# EAGLE board hoektronics-cnc-controller (EAGLE 5.12)
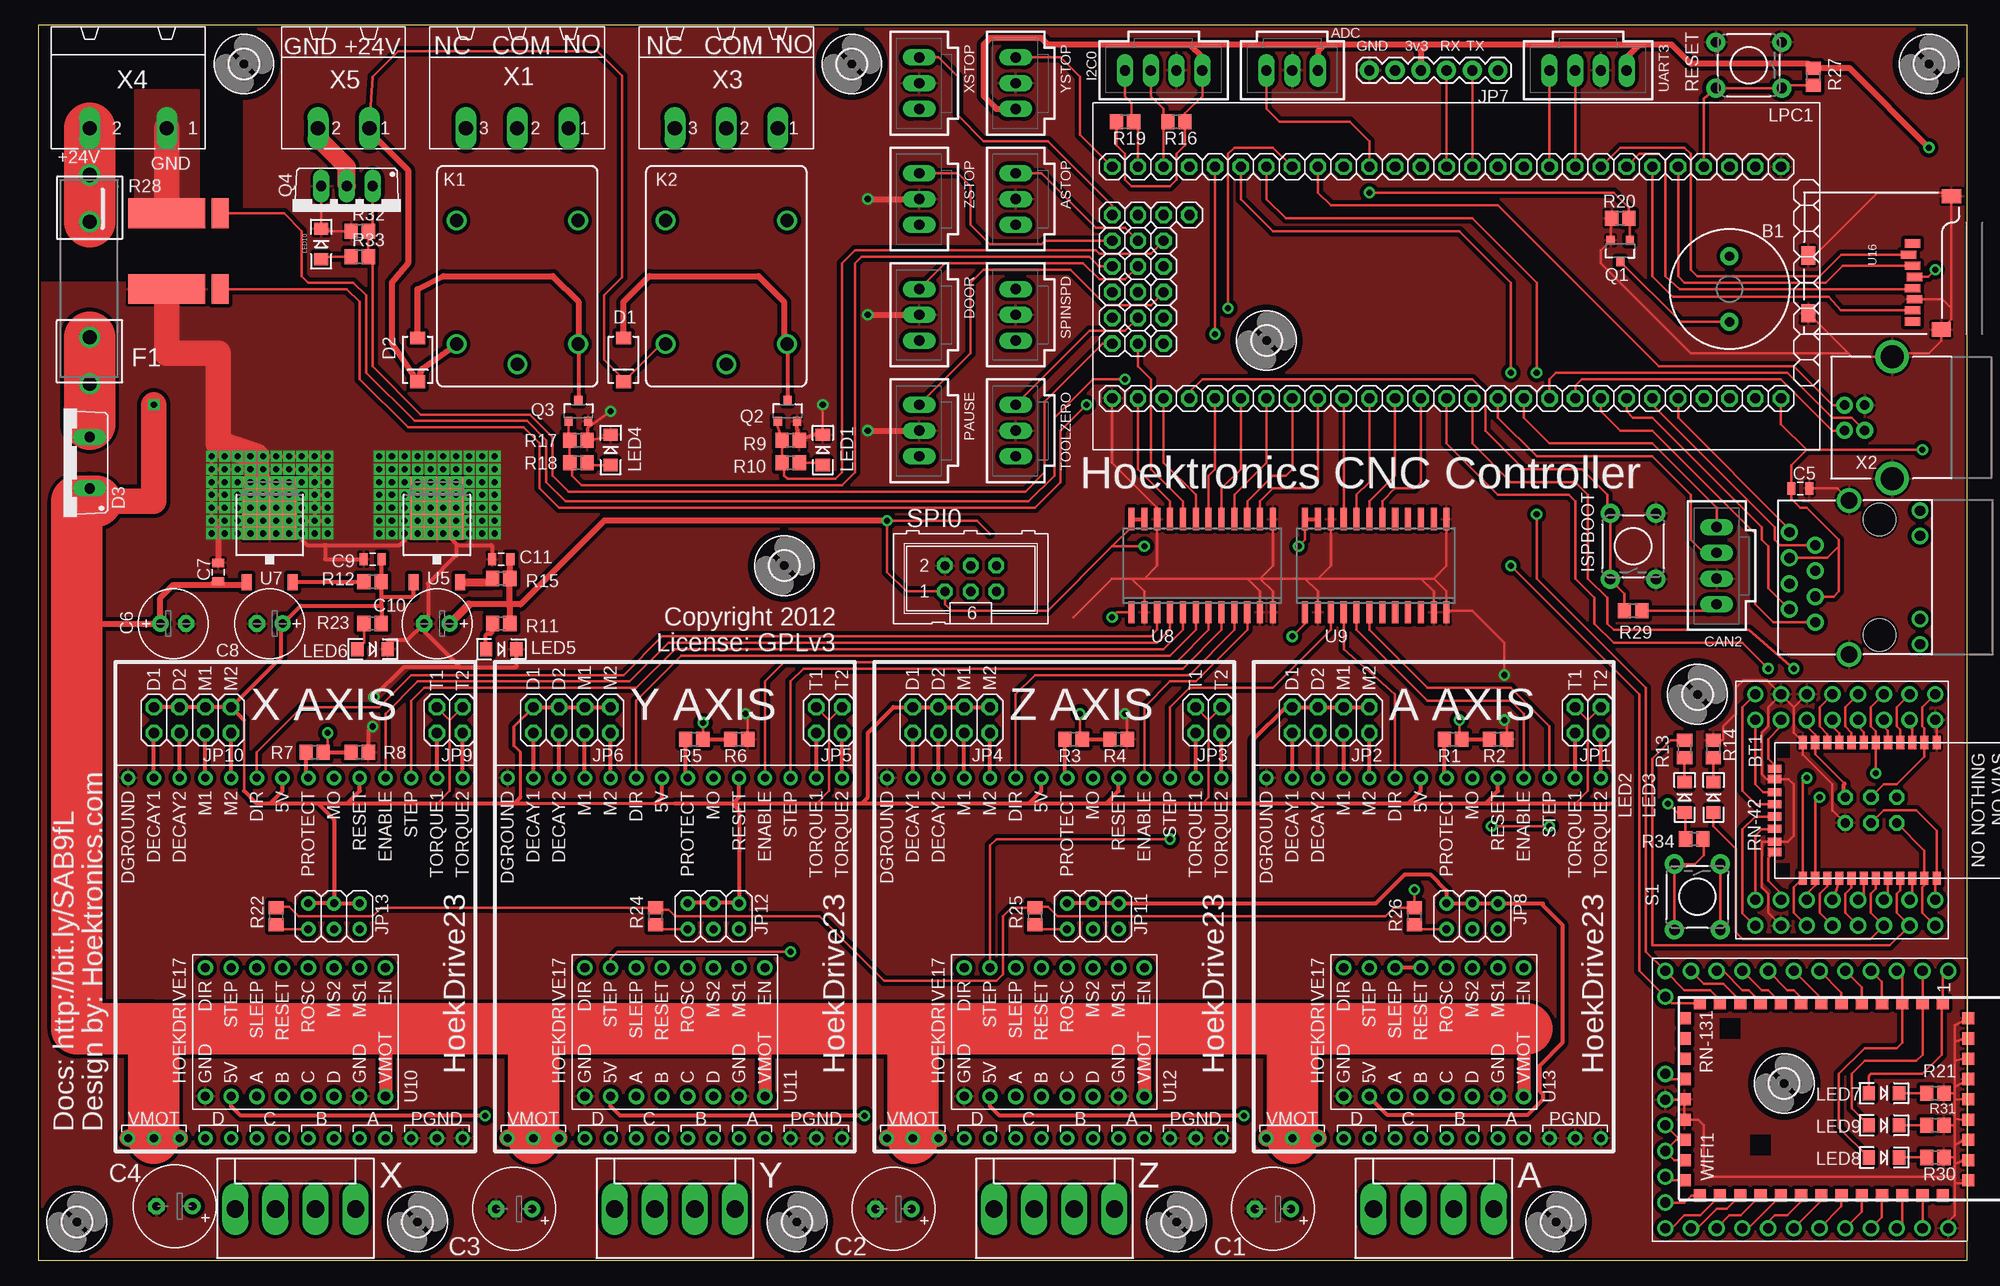
[diagram p9: board, top side]
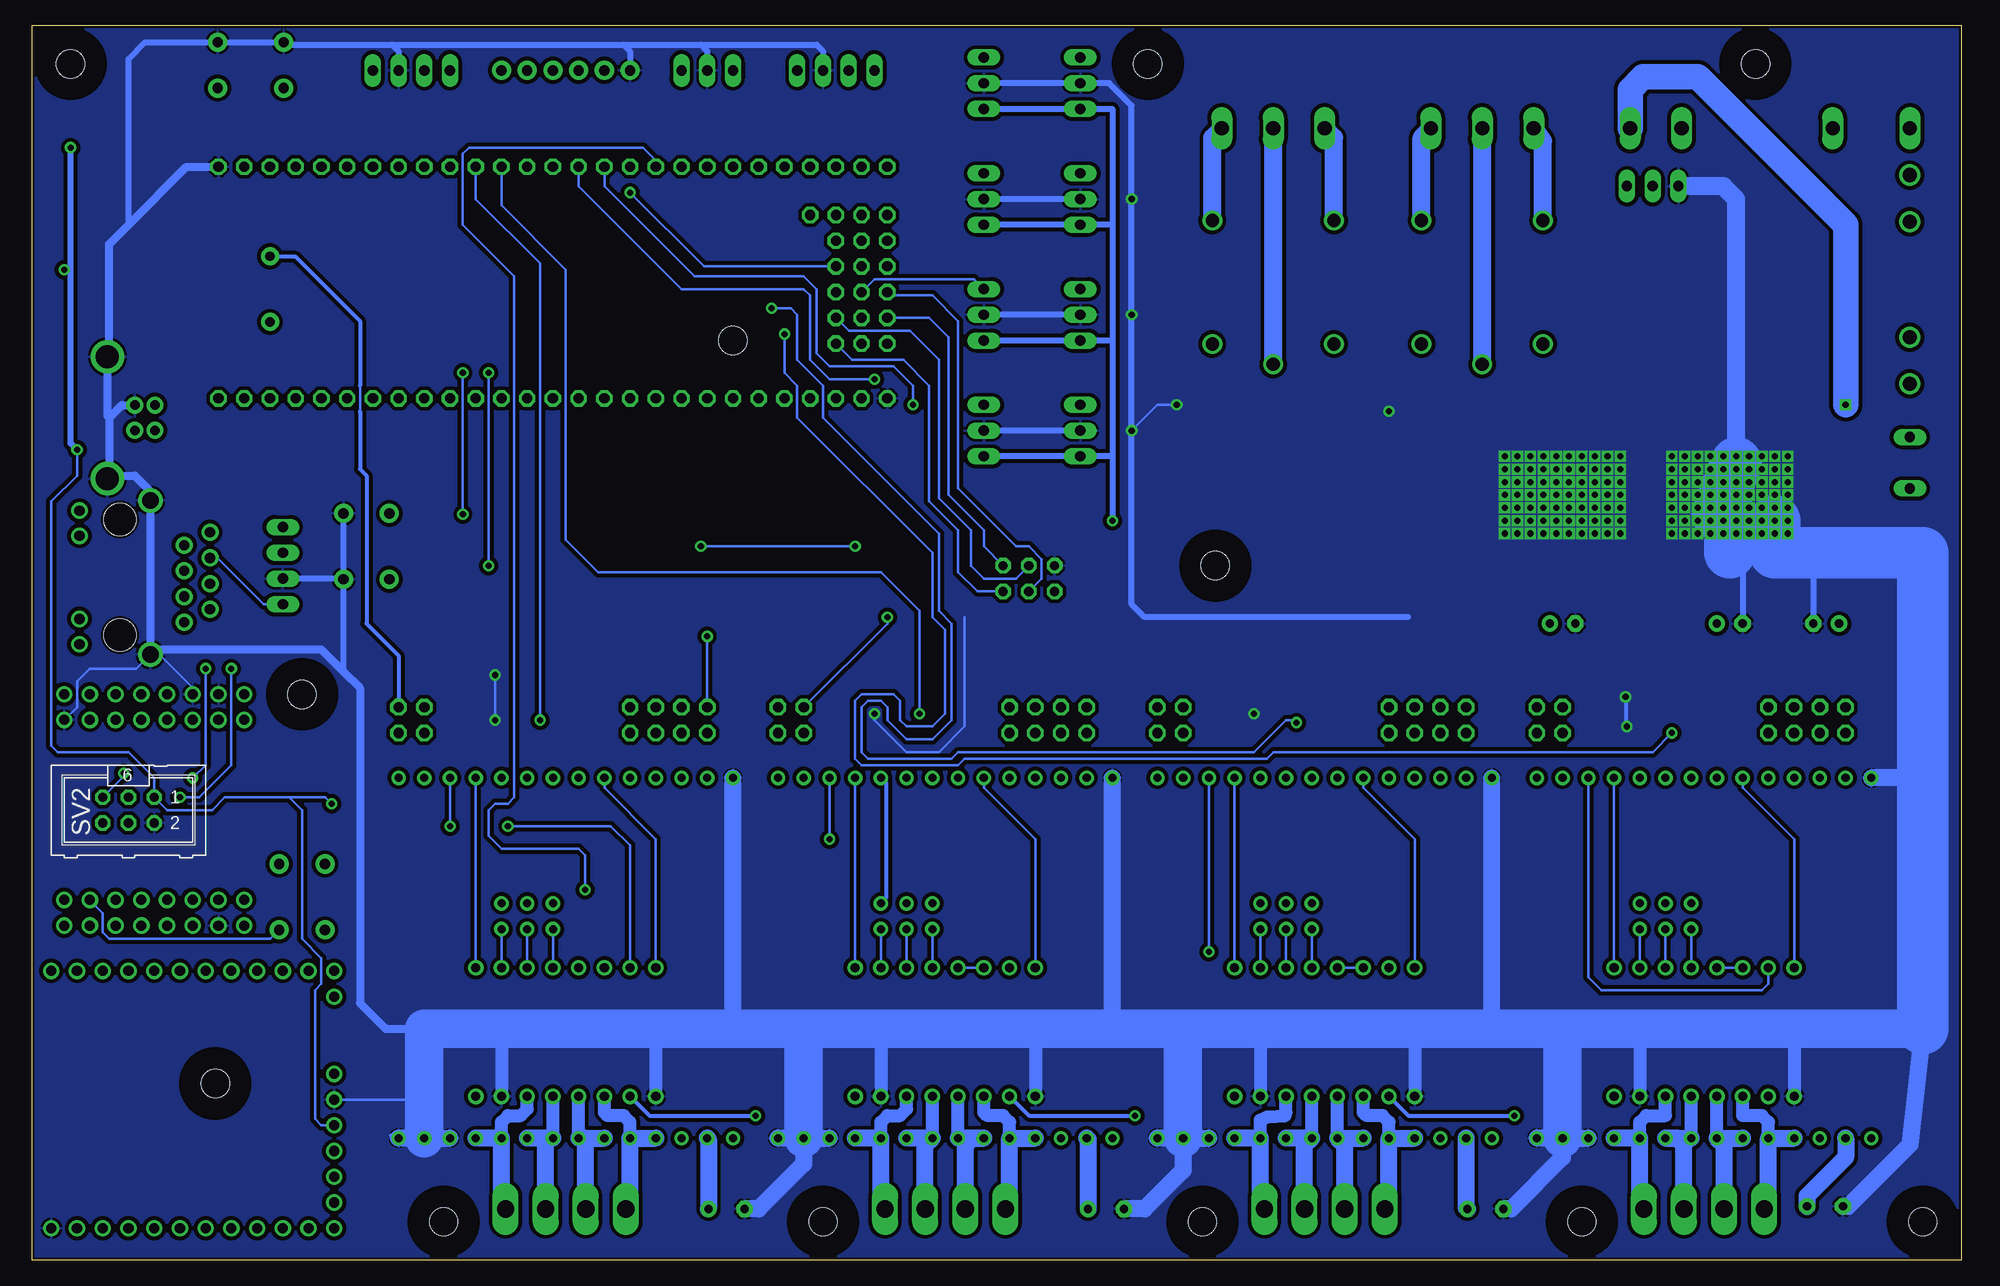
[diagram p10: board, bottom side, seen from below]

Size 190.5 x 121.92 mm. Coordinates in mm from the lower left corner, seen from the top.
Outline: 190.5,121.92 0,121.92 0,0 190.5,0 190.5,121.92
Copper layers (1*16): Top 0.035mm / dielectric 1.5mm / Bottom 0.035mm
Design rules "hoektronics *": minimum track width 8mil, minimum drill 20mil, track to track 8mil, track to pad 8mil, pad to pad 8mil, via to via 8mil, smd to smd 8mil, copper to edge 10mil, drill to drill 8mil, minimum pad ring 12mil, minimum via ring 10mil, stop-mask expansion 4mil, vias tented up to drill 25mil, thermal gap 10mil
Net classes: 0 default: width 0.406 mm, clearance 0.381 mm; 1 power: width 1.524 mm, clearance 0.635 mm; 2 highvolt: width 1.778 mm, clearance 3.175 mm; 3 signals: width 0.254 mm, clearance 0.318 mm

## Footprints (pad centres in the part's own frame; a part is rotated, then mirrored left to right if it is on the bottom)
KK-156-4 = drill 1.7 pad 2.184 long: 1 -5.94,0; 2 -1.98,0; 3 1.98,0; 4 5.94,0
70543-03 = drill 1.016 long: 1 -2.54,0; 2 0,0; 3 2.54,0
BUZZER-12MM = drill 0.9 pad 1.778 round: + 3.25,0; - -3.25,0
RN-42 = smd 1.3 x 0.8: 1 0,16; 2 0,14.8; 3 0,13.6; 4 0,12.4; 5 0,11.2; 6 0,10; 7 0,8.8; 8 0,7.6; 9 0,6.4; 10 0,5.2; 11 0,4; 12 0,2.8; 13 13.4,2.8; 14 13.4,4; 15 13.4,5.2; 16 13.4,6.4; 17 13.4,7.6; 18 13.4,8.8; 19 13.4,10; 20 13.4,11.2; 21 13.4,12.4; 22 13.4,13.6; 23 13.4,14.8; 24 13.4,16 | smd 0.8 x 1.3: 28 9.8,0; 29 3.6,0; 30 10.8,0; 31 8.5,0; 32 7.3,0; 33 6.1,0; 34 4.9,0; 35 2.6,0
RN-42-CARRIER = drill 1 round: P$1 -2.237,15.875; P$2 -4.777,15.875; P$3 -2.237,13.335; P$4 -4.777,13.335; P$5 -2.237,10.795; P$6 -4.777,10.795; P$7 -2.237,8.255; P$8 -4.777,8.255; P$9 -2.237,5.715; P$10 -4.777,5.715; P$11 -2.237,3.175; P$12 -4.777,3.175; P$13 -2.237,0.635; P$14 -4.777,0.635; P$15 -2.237,-1.905; P$16 -4.777,-1.905; P$17 18.067,-1.905; P$18 15.527,-1.905; P$19 18.067,0.635; P$20 15.527,0.635; P$21 18.067,3.175; P$22 15.527,3.175; P$23 18.067,5.715; P$24 15.527,5.715; P$25 18.067,8.255; P$26 15.527,8.255; P$27 18.067,10.795; P$28 15.527,10.795; P$29 18.067,13.335; P$30 15.527,13.335; P$31 18.067,15.875; P$32 15.527,15.875
E3,5-8 = drill 0.813 pad 1.6 round: + -1.778,0 | drill 0.813 pad 1.6 octagon: - 1.778,0
0805 = smd 0.8 x 1.2: 1 -0.9,0; 2 0.9,0
E2,5-7 = drill 0.813 pad 1.6 round: + -1.27,0 | drill 0.813 pad 1.6 octagon: - 1.27,0
70543-04 = drill 1.016 long: 1 -3.81,0; 2 -1.27,0; 3 1.27,0; 4 3.81,0
SMA-DIODE = smd 1.27 x 1.47: A -2.15,0; C 2.15,0
DO220S = drill 1.016 long: A 2.54,-2.54; C -2.54,-2.54
FUSE_5MM = drill 1.4 round: 1 0,10.3; 2 0,5.7; 3 0,-5.7; 4 0,-10.3
2,8 = hole 2.8: 0,0
TACTILE-PTH = drill 1.016 pad 1.88 round: 1 -3.251,2.261; 2 3.251,2.261; 3 -3.251,-2.261; 4 3.251,-2.261
2X02 = drill 1.016 octagon: 1 -1.27,-1.27; 2 -1.27,1.27; 3 1.27,-1.27; 4 1.27,1.27
2X04 = drill 1.016 octagon: 1 -3.81,-1.27; 2 -3.81,1.27; 3 -1.27,-1.27; 4 -1.27,1.27; 5 1.27,-1.27; 6 1.27,1.27; 7 3.81,-1.27; 8 3.81,1.27
1X06 = drill 1.016 pad 1.88 round: 1 0,0; 2 2.54,0; 3 5.08,0; 4 7.62,0; 5 10.16,0; 6 12.7,0
2X03 = drill 0.8 round: 1 -2.54,-1.27; 2 -2.54,1.27; 3 0,-1.27; 4 0,1.27; 5 2.54,-1.27; 6 2.54,1.27
JS-M = drill 1.3 round: 1 6.7,6; 2 6.7,-6; C 8.7,0; NC -5.5,-6; NO -5.5,6
LED-1206 = smd 1.2 x 1.4: A -1.5,0; C 1.5,0
LPCXPRESSO_LPC1769 = drill 1 octagon: 1 3.81,6.35; 2 6.35,6.35; 3 8.89,6.35; 4 11.43,6.35; 5 13.97,6.35; 6 16.51,6.35; 7 19.05,6.35; 8 21.59,6.35; 9 24.13,6.35; 10 26.67,6.35; 11 29.21,6.35; 12 31.75,6.35; 13 34.29,6.35; 14 36.83,6.35; 15 39.37,6.35; 16 41.91,6.35; 17 44.45,6.35; 18 46.99,6.35; 19 49.53,6.35; 20 52.07,6.35; 21 54.61,6.35; 22 57.15,6.35; 23 59.69,6.35; 24 62.23,6.35; 25 64.77,6.35; 26 67.31,6.35; 27 69.85,6.35; 28 3.81,29.21; 29 6.35,29.21; 30 8.89,29.21; 31 11.43,29.21; 32 13.97,29.21; 33 16.51,29.21; 34 19.05,29.21; 35 21.59,29.21; 36 24.13,29.21; 37 26.67,29.21; 38 29.21,29.21; 39 31.75,29.21; 40 34.29,29.21; 41 36.83,29.21; 42 39.37,29.21; 43 41.91,29.21; 44 44.45,29.21; 45 46.99,29.21; 46 49.53,29.21; 47 52.07,29.21; 48 54.61,29.21; 49 57.15,29.21; 50 59.69,29.21; 51 62.23,29.21; 52 64.77,29.21; 53 67.31,29.21; 54 69.85,29.21; 55 62.23,11.1; 56 64.77,11.1; 57 67.31,11.1; 58 69.85,11.1; 59 64.77,13.64; 60 67.31,13.64; 61 69.85,13.64; 62 64.77,16.18; 63 67.31,16.18; 64 69.85,16.18; 65 64.77,18.72; 66 67.31,18.72; 67 69.85,18.72; 68 64.77,21.26; 69 67.31,21.26; 70 69.85,21.26; 71 64.77,23.8; 72 67.31,23.8; 73 69.85,23.8
SOT23-3 = smd 0.8 x 0.9: 1 -0.95,-1; 2 0.95,-1; 3 0,1.1
TO220BV = drill 1.016 long: D 0,-2.54; G -2.54,-2.54; S 2.54,-2.54
R0805 = smd 1.3 x 1.5: 1 -0.85,0; 2 0.85,0
WSL3637 = smd 7.62 x 2.946: 1 3.81,8.738; 4 3.81,1.27 | smd 1.676 x 2.946: 2 9.068,8.738; 3 9.068,1.27
ML6 = drill 0.914 octagon: 1 -2.54,-1.27; 2 -2.54,1.27; 3 0,-1.27; 4 0,1.27; 5 2.54,-1.27; 6 2.54,1.27
HOEKSTEP23 = drill 0.8 round: A1 17.78,7.62; A2 17.78,5.08; B1 17.78,2.54; B2 17.78,0; C1 17.78,-2.54; C2 17.78,-5.08; CLOCK -17.78,10.16; D1 17.78,-7.62; D2 17.78,-10.16; DCY1 -17.78,-15.24; DCY2 -17.78,-12.7; DGND -17.78,-17.78; DIR -17.78,-5.08; EN -17.78,7.62; M1 -17.78,-10.16; M2 -17.78,-7.62; MO -17.78,2.54; PGND1 17.78,15.24; PGND2 17.78,12.7; PGND3 17.78,10.16; PROTECT -17.78,0; RESET -17.78,5.08; TQ1 -17.78,12.7; TQ2 -17.78,15.24; VCC -17.78,-2.54; VMOT1 17.78,-12.7; VMOT2 17.78,-15.24; VMOT3 17.78,-17.78
TO252 = smd 1 x 1.6: 1 -2.28,-4.8; 2 2.28,-4.8 | smd 5.4 x 6.2: 3 0,2.5
MAGJACK = drill 1 pad 1.676 round: 1 3.175,17.445; 2 4.445,19.985; 3 5.715,17.445; 4 6.985,19.985; 5 8.255,17.445; 6 9.525,19.985; 7 10.795,17.445; 8 12.065,19.985 | drill 1 pad 1.27 round: 9 1,7.1; 10 3.5,7.1; 11 11.7,7.1; 12 14.2,7.1 | drill 1.6 pad 2.184 round: GNDL 0,14.1; GNDR 15.2,14.1 | hole 3.2: 1.905,11.095; 13.335,11.095
SO24W = smd 0.6 x 2.2: 1 -6.985,-4.6; 2 -5.715,-4.6; 3 -4.445,-4.6; 4 -3.175,-4.6; 5 -1.905,-4.6; 6 -0.635,-4.6; 7 0.635,-4.6; 8 1.905,-4.6; 9 3.175,-4.6; 10 4.445,-4.6; 11 5.715,-4.6; 12 6.985,-4.6; 13 6.985,4.6; 14 5.715,4.6; 15 4.445,4.6; 16 3.175,4.6; 17 1.905,4.6; 18 0.635,4.6; 19 -0.635,4.6; 20 -1.905,4.6; 21 -3.175,4.6; 22 -4.445,4.6; 23 -5.715,4.6; 24 -6.985,4.6
HOEKSTEP17 = drill 0.9 round: A -6.35,-5.08; B -6.35,-7.62; C -6.35,-10.16; D -6.35,-12.7; DIR 6.35,0; ENABLE 6.35,-17.78; GND1 -6.35,0; GND2 -6.35,-15.24; MS1 6.35,-15.24; MS2 6.35,-12.7; RESET 6.35,-7.62; ROSC 6.35,-10.16; SLEEP 6.35,-5.08; STEP 6.35,-2.54; VCC -6.35,-2.54; VMOT -6.35,-17.78
MICRO-SD-SOCKET-PP = smd 0.8 x 1.5: 1 -8.94,10.7; 2 -7.84,10.3; 3 -6.74,10.7; 4 -5.64,10.9; 5 -4.54,10.7; 6 -3.44,10.9; 7 -2.34,10.7; 8 -1.24,10.7 | smd 1.8 x 1.4: CD1 -2.05,0.4; CD2 -7.75,0.4 | smd 1.4 x 1.9: GND1 -13.6,14.55; GND3 -0.45,13.55
RN-131 = smd 1.2 x 1.2: 1 0,25.5; 2 0,23.5; 3 0,21.5; 4 0,19.5; 5 0,17.5; 6 0,15.5; 7 0,13.5; 8 0,11.5; 9 0,9.5; 10 0,7.5; 11 0,5.5; 12 0,3.5; 13 0,1.5; 14 1.5,0; 15 3.5,0; 16 5.5,0; 17 7.5,0; 18 9.5,0; 19 11.5,0; 20 13.5,0; 21 15.5,0; 22 17.5,0; 23 19,1.5; 24 19,3.5; 25 19,5.5; 26 19,7.5; 27 19,9.5; 28 19,11.5; 29 19,13.5; 30 19,15.5; 31 19,17.5; 32 19,19.5; 33 19,21.5; 34 19,23.5; 35 19,25.5; 36 17.5,28; 37 15.5,28; 38 13.5,28; 39 11.5,28; 40 9.5,28; 41 7.5,28; 42 5.5,28; 43 3.5,28; 44 1.5,28
RN-131-CARRIER = drill 1 round: 1 -3.175,26.035; 2 -3.175,23.495; 3 -3.175,20.955; 4 -3.175,18.415; 5 -3.175,15.875; 6 -3.175,13.335; 7 -3.175,10.795; 8 -3.175,8.255; 9 -3.175,5.715; 10 -3.175,3.175; 11 -3.175,0.635; 12 -3.175,-1.905; 13 -0.635,-1.905; 14 6.985,-1.905; 15 9.525,-1.905; 17 12.065,-1.905; 18 14.605,-1.905; 19 17.145,-1.905; 20 19.685,-1.905; 21 22.225,-1.905; 22 22.225,0.635; 23 22.225,3.175; 24 22.225,5.715; 25 22.225,8.255; 26 22.225,10.795; 27 22.225,13.335; 28 22.225,15.875; 29 22.225,18.415; 30 22.225,20.955; 31 22.225,23.495; GND1 22.225,26.035 | smd 0.5 x 0.5: GND2 17.5,28; GND3 15.5,28; GND4 13.5,28; GND5 11.5,28; GND6 9.5,28; GND7 7.5,28; GND8 5.5,28; GND9 3.5,28; GND10 1.5,28; NC1 1.5,0; NC2 3.5,0; NC3 5.5,0; NC4 19,25.5
MSTBA3 = drill 1.397 long: 1 -5.08,5.08; 2 0,5.08; 3 5.08,5.08
USB-B-PTH = drill 0.914 pad 1.676 round: D+ 0,1.25; D- 1.981,1.25; GND 0,-1.25; VBUS 1.981,-1.25 | drill 2.286 round: P$1 -2.718,-6.02; P$2 -2.718,6.02
GMSTBA2 = drill 1.397 long: 1 -3.81,5.08; 2 3.81,5.08
MSTBA2 = drill 1.397 long: 1 -2.54,5.08; 2 2.54,5.08

## Placement (x,y rotation side)
A  [KK-156-4]  137.79,5.08 0 top
ADC  C-GRID-03-70543  [70543-03]  123.83,117.47 180 top
ASTOP  C-GRID-03-70543  [70543-03]  96.52,104.78 90 top
B1  BUZZERPTH  [BUZZER-12MM]  167,95.89 90 top
BT1  RN-42  [RN-42]  171.45,51.12 270 top
BT2  RN-42PTC  [RN-42-CARRIER]  171.45,51.12 270 top
C1  470uF  [E3,5-8]  121.92,5.08 180 top
C2  470uF  [E3,5-8]  84.45,5.08 180 top
C3  470uF  [E3,5-8]  46.99,5.08 180 top
C4  470uF  [E3,5-8]  13.46,5.33 180 top
C5  100nF  [0805]  173.99,76.2 0 top
C6  100uF  [E2,5-7]  13.34,62.87 0 top
C7  100nF  [0805]  17.78,67.94 90 top
C8  100uF  [E2,5-7]  22.86,62.87 180 top
C9  100nF  [0805]  33.02,69.22 180 top
C10  100uF  [E2,5-7]  39.37,62.87 180 top
C11  100nF  [0805]  45.72,69.22 180 top
CAN2  C-GRID-04-70543  [70543-04]  165.74,68.58 90 top
D1  1N4001  [SMA-DIODE]  57.78,88.9 270 top
D2  1N4001  [SMA-DIODE]  37.47,88.9 270 top
D3  VS-ETH1506FP-M3  [DO220S]  2.54,78.74 90 top
DOOR  C-GRID-03-70543  [70543-03]  87,93.34 90 top
F1  FUSEX20MM  [FUSE_5MM]  5.08,96.84 0 top
H1  MOUNT-HOLE2.8  [2,8]  3.81,3.81 0 top
H2  MOUNT-HOLE2.8  [2,8]  37.47,3.81 0 top
H3  MOUNT-HOLE2.8  [2,8]  74.93,3.81 0 top
H4  MOUNT-HOLE2.8  [2,8]  112.39,3.81 0 top
H5  MOUNT-HOLE2.8  [2,8]  149.86,3.81 0 top
H6  MOUNT-HOLE2.8  [2,8]  172.4,17.46 0 top
H7  MOUNT-HOLE2.8  [2,8]  186.69,118.11 0 top
H8  MOUNT-HOLE2.8  [2,8]  163.83,55.88 0 top
H9  MOUNT-HOLE2.8  [2,8]  80.33,118.11 0 top
H10  MOUNT-HOLE2.8  [2,8]  20.32,118.11 0 top
H11  MOUNT-HOLE2.8  [2,8]  73.66,68.58 0 top
H12  MOUNT-HOLE2.8  [2,8]  121.28,90.81 0 top
I2C0  C-GRID-04-70543  [70543-04]  111.12,117.47 180 top
ISPBOOT  [TACTILE-PTH]  157.48,70.48 90 top
JP1  [2X02]  153.03,53.34 180 top
JP2  [2X04]  127.64,53.34 180 top
JP3  [2X02]  115.57,53.34 180 top
JP4  [2X04]  90.17,53.34 180 top
JP5  [2X02]  78.11,53.34 180 top
JP6  [2X04]  52.7,53.34 180 top
JP7  [1X06]  131.44,117.47 0 top
JP8  [2X03]  141.6,33.97 180 top
JP9  [2X02]  40.64,53.34 180 top
JP10  [2X04]  15.24,53.34 180 top
JP11  [2X03]  104.14,33.97 180 top
JP12  [2X03]  66.67,33.97 180 top
JP13  [2X03]  29.21,33.97 180 top
K1  JS-M1-12V-5  [JS-M]  47.31,97.16 270 top
K2  JS-M1-12V-5  [JS-M]  67.94,97.16 270 top
LED1  [LED-1206]  77.47,80.01 90 top
LED2  [LED-1206]  162.56,45.72 90 top
LED3  [LED-1206]  165.42,45.72 90 top
LED4  [LED-1206]  56.52,80.01 90 top
LED5  [LED-1206]  45.72,60.33 0 top
LED6  [LED-1206]  33.02,60.33 0 top
LED7  [LED-1206]  182.25,16.51 0 top
LED8  [LED-1206]  182.25,10.16 0 top
LED9  [LED-1206]  182.25,13.34 0 top
LED10  [LED-1206]  27.94,100.33 90 top
LPC1  [LPCXPRESSO_LPC1769]  175.9,114.3 180 top
PAUSE  C-GRID-03-70543  [70543-03]  87,81.92 90 top
Q1  MOSFET-NCHANNELSMD  [SOT23-3]  156.21,99.69 180 top
Q2  MOSFET-NCHANNELSMD  [SOT23-3]  73.98,83.82 0 top
Q3  MOSFET-NCHANNELSMD  [SOT23-3]  53.34,83.82 0 top
Q4  IRF520  [TO220BV]  30.48,103.5 180 top
R1  22K  [R0805]  139.7,51.44 180 top
R2  39K  [R0805]  144.15,51.44 180 top
R3  22K  [R0805]  102.23,51.44 180 top
R4  39K  [R0805]  106.68,51.44 180 top
R5  22K  [R0805]  64.77,51.44 180 top
R6  39K  [R0805]  69.22,51.44 180 top
R7  22K  [R0805]  27.3,50.16 180 top
R8  39K  [R0805]  31.75,50.16 180 top
R9  10k  [R0805]  74.3,80.96 180 top
R10  220  [R0805]  74.3,78.74 180 top
R11  220  [R0805]  45.72,62.87 0 top
R12  0  [R0805]  33.02,66.99 180 top
R13  220  [R0805]  162.56,50.48 270 top
R14  220  [R0805]  165.42,50.48 270 top
R15  0  [R0805]  45.72,67.31 180 top
R16  560  [R0805]  112.39,112.39 0 top
R17  10k  [R0805]  53.34,80.96 180 top
R18  220  [R0805]  53.34,78.74 180 top
R19  560  [R0805]  107.31,112.39 180 top
R20  10k  [R0805]  156.21,102.87 0 top
R21  220  [R0805]  187.32,16.51 180 top
R22  0  [R0805]  23.5,33.97 270 top
R23  560  [R0805]  33.02,62.87 0 top
R24  0  [R0805]  60.96,33.97 270 top
R25  0  [R0805]  98.42,33.97 270 top
R26  0  [R0805]  135.89,33.97 270 top
R27  10k  [R0805]  175.26,116.84 90 top
R28  WSL3637  [WSL3637]  8.89,94.61 0 top
R29  10k  [R0805]  157.48,64.14 0 top
R30  220  [R0805]  187.32,10.16 180 top
R31  220  [R0805]  187.32,13.34 180 top
R32  10k  [R0805]  31.75,101.6 0 top
R33  220  [R0805]  31.75,99.06 0 top
R34  1K  [R0805]  163.51,41.59 0 top
RESET  [TACTILE-PTH]  168.91,117.98 180 top
S1  [TACTILE-PTH]  163.83,35.88 270 top
SPI0  [ML6]  92.08,67.31 0 top
SPINSPD  C-GRID-03-70543  [70543-03]  96.52,93.34 90 top
SV2  [ML6]  180.97,44.45 180 bottom
TOOLZERO  C-GRID-03-70543  [70543-03]  96.52,81.92 90 top
U1  HOEKSTEP23  [HOEKSTEP23]  26.67,29.84 270 top
U2  HOEKSTEP23  [HOEKSTEP23]  64.14,29.84 270 top
U3  HOEKSTEP23  [HOEKSTEP23]  101.6,29.84 270 top
U4  HOEKSTEP23  [HOEKSTEP23]  139.06,29.84 270 top
U5  IXF25001  [TO252]  39.37,71.75 0 top
U6  MAGJACK  [MAGJACK]  192.91,59.82 90 top
U7  IXF25001  [TO252]  22.86,71.75 0 top
U8  SN74LVC4245ADW  [SO24W]  114.94,68.58 0 top
U9  SN74LVC4245ADW  [SO24W]  132.08,68.58 0 top
U10  HOEKSTEP17  [HOEKSTEP17]  16.51,22.54 90 top
U11  HOEKSTEP17  [HOEKSTEP17]  53.98,22.54 90 top
U12  HOEKSTEP17  [HOEKSTEP17]  91.44,22.54 90 top
U13  HOEKSTEP17  [HOEKSTEP17]  128.91,22.54 90 top
U16  USD-SOCKETNEW  [MICRO-SD-SOCKET-PP]  174.37,91.44 270 top
UART3  C-GRID-04-70543  [70543-04]  153.03,117.47 180 top
WIFI1  RN-131  [RN-131]  162.56,25.4 270 top
WIFI2  RN-131PTC  [RN-131-CARRIER]  162.56,25.4 270 top
X  [KK-156-4]  25.4,5.08 0 top
X1  MSTBA3  [MSTBA3]  47.31,116.84 180 top
X2  USBPTH  [USB-B-PTH]  180.34,83.19 180 top
X3  MSTBA3  [MSTBA3]  67.94,116.84 180 top
X4  GMSTBA2  [GMSTBA2]  8.89,116.84 180 top
X5  MSTBA2  [MSTBA2]  30.16,116.84 180 top
XSTOP  C-GRID-03-70543  [70543-03]  87,116.2 90 top
Y  [KK-156-4]  62.87,5.08 0 top
YSTOP  C-GRID-03-70543  [70543-03]  96.52,116.2 90 top
Z  [KK-156-4]  100.33,5.08 0 top
ZSTOP  C-GRID-03-70543  [70543-03]  87,104.78 90 top

## Tracks (layer width: path | path; a pad name or v marks a point on that pad's centre or on a via)
3.3V  (via drill 0.6)
  Top 0.254: U6.6 176.66,69.34 177.8,70.48 | U6.3 177.29,65.53 177.8,66.04 177.8,70.48 | 177.8,70.48 177.8,71.12 174.62,74.3 173.99,74.3 173.09,75.19 C5.1 173.09,78.47 174.62,80.01 | I2C0.1 114.94,114.94 113.25,113.25 R16.2 113.25,110.07 112.39,109.22 112.39,106.68 111.76,106.05 107.95,106.05 107.31,106.68 107.31,109.22 106.47,110.07 R19.2 | WIFI1.21 161.55,9.9 WIFI2.18 161.76,11.9 162.09,11.9 | BT2.P$11 174.62,52.7 175.45,51.88 BT1.11 175.45,49.98 178.37,47.05 178.44,46.99 | 162.66,44.12 LED2.A | 162.09,11.9 WIFI1.20 | WIFI2.17 162.09,11.9 | 174.62,80.01 v186.06,80.01 | R29.2 165.1,64.14 CAN2.1 | U8.24 107.95,72.39 106.05,70.48 | U9.24 125.09,71.12 v124.46,70.48 | 106.05,70.48 v109.22,70.48 | 93.98,71.75 92.71,73.03 v83.82,73.03 83.82,67.94 85.72,66.04 SPI0.1 89.53,64.77 90.17,64.14 99.69,64.14 106.05,70.48 | U16.4 186.62,97.08 v187.32,97.79 | 162.66,44.12 161.88,44.12 v160.91,45.09 | 162.66,44.12 R34.1 | LPC1.28 172.09,82.55 174.62,80.01
  Top 0.406: U8.24 U8.23 | U9.24 U9.23 | SV2.1 178.31,45.85 178.31,46.99 178.37,47.05
  Top 0.61: 158.12,120.02 161.29,120.02 163.19,118.11 174.84,118.11 R27.2 178.85,117.69 v186.69,109.86 | 158.12,120.02 137.16,120.02 | 137.16,120.02 127,120.02 | UART3.1 156.84,118.75 158.12,120.02 | JP7.3 136.53,119.38 137.16,120.02 | ADC.1 126.36,119.38 127,120.02 | v83.82,73.03 55.88,73.03 47.62,64.77 46.35,64.77 | 46.35,64.77 42.55,64.77 | C11.1 46.62,67.36 R15.1 46.57,64.98 46.35,64.77 | R11.2 46.57,64.56 46.35,64.77 | 127,120.02 113.67,120.02 | 113.67,120.02 99.69,120.02 99.06,120.65 93.98,120.65 93.34,120.02 93.34,114.94 94.61,113.67 YSTOP.1 | I2C0.1 114.94,118.75 113.67,120.02
  Top 0.813: 42.55,64.77 C10.+
  Bottom 0.254: U6.6 172.21,69.34 167.64,64.77 CAN2.1 | v160.91,45.09 161.54,45.72 165.1,45.72 | 165.1,45.72 171.45,45.72 172.72,44.45 177.16,44.45 SV2.1 178.44,47.62 180.97,50.16 187.96,50.16 188.59,50.8 188.59,74.93 186.06,77.47 v186.06,80.01 | WIFI2.17 161.93,13.34 162.56,13.97 162.56,26.67 161.93,27.3 161.93,29.84 163.83,31.75 163.83,44.45 165.1,45.72 | v109.22,70.48 v124.46,70.48 | 186.69,98.42 v187.32,97.79
  Bottom 0.61: v186.69,109.86 186.69,98.42 186.69,80.64 v186.06,80.01 | 83.82,79.38 v83.82,73.03 | 83.82,90.81 83.82,79.38 | 83.82,102.23 83.82,90.81 | 83.82,102.23 83.82,113.67 XSTOP.1 YSTOP.1 | TOOLZERO.1 PAUSE.1 83.82,79.38 | 83.82,90.81 DOOR.1 SPINSPD.1 | 83.82,102.23 ZSTOP.1 ASTOP.1
5V  (via drill 0.6)
  Top 0.254: 151.76,45.09 153.03,46.35 153.03,53.34 | JP1.1 153.03,53.34 | 153.03,53.34 JP1.3 | 115.57,53.34 JP3.3 | 115.57,53.34 115.57,45.72 114.94,45.09 | 115.57,53.34 JP3.1 | 78.11,53.34 JP5.3 | 78.11,53.34 78.11,46.35 76.83,45.09 | 78.11,53.34 JP5.1 | 40.64,53.34 JP9.3 | 40.64,53.34 40.64,46.35 39.37,45.09 | 40.64,53.34 JP9.1 | 20.32,46.35 20.32,53.34 | U8.1 106.53,63.98 v106.05,63.5 | U9.1 125.09,62.87 v123.83,61.59
  Top 0.305: 48.26,45.09 60.96,45.09 62.87,45.09 | JP6.7 46.99,52.7 46.99,50.8 47.62,50.16 47.62,45.72
  Top 0.406: JP2.1 JP2.3 JP2.5 JP2.7 123.19,54.61 120.02,51.44 120.02,45.09 | JP4.1 JP4.3 JP4.5 JP4.7 84.45,54.61 81.92,52.07 81.92,45.72 81.28,45.09 | JP6.1 JP6.3 JP6.5 JP6.7 | 142.88,45.09 135.25,45.09 | 142.88,45.09 151.76,45.09 155.26,45.09 | 135.25,45.09 120.02,45.09 | 105.41,45.09 114.94,45.09 120.02,45.09 | 105.41,45.09 97.79,45.09 | 68.58,45.09 62.87,45.09 | 68.58,45.09 76.83,45.09 81.28,45.09 | 97.79,45.09 81.28,45.09 | 135.25,45.09 136.53,46.35 U4.VCC | JP10.7 JP10.5 JP10.3 JP10.1 | 142.88,45.09 144.15,46.35 U4.RESET | 105.41,45.09 106.68,46.35 U3.RESET | 97.79,45.09 99.06,46.35 U3.VCC | 68.58,45.09 69.22,45.72 U2.RESET | 60.96,45.09 61.59,45.72 U2.VCC | 30.48,45.09 27.62,45.09 | 27.62,45.09 22.86,45.09 | 30.48,45.09 39.37,45.09 46.99,45.09 | 48.26,45.09 46.99,45.09 | 46.99,45.09 47.62,45.72 | 30.48,45.09 31.75,46.35 U1.RESET | 22.86,45.09 24.13,46.35 U1.VCC | 20.32,46.35 21.59,45.09 22.86,45.09 | 20.32,53.34 JP10.1 | U12.VCC 93.98,15.24 94.93,14.29 v119.06,14.29 | U11.VCC 56.52,15.24 57.47,14.29 v81.6,14.29 | U10.VCC 19.05,15.24 20,14.29 v44.13,14.29 | JP11.5 JP11.3 JP11.1 132.08,35.24 134.94,38.1 137.48,38.1 139.06,36.51 JP8.5 JP8.3 JP8.1 148.59,35.24 148.59,35.05 150.5,33.15 150.5,21.46 148.21,19.18 148.21,16.76 148.59,16.38 148.59,15.88 147.07,14.35 133.22,14.35 131.44,16.13 U13.VCC | JP13.3 29.21,43.5 27.62,45.09 | JP13.3 JP13.5 | JP13.3 JP13.1 | JP12.5 64.26,35.31 66.67,35.31 JP12.3 66.8,35.31 69.22,35.31 | 69.22,35.31 JP12.1 | C9.1 33.91,69.22 33.91,67.06 R12.1 33.91,66.8 33.91,65.53 | 33.91,64.64 33.91,65.53 | 33.91,64.64 33.91,62.87 R23.2 | U5.1 37.08,66.93 37.08,65.66 36.96,65.53 33.91,65.53
  Top 0.406: 33.91,64.64 25.91,64.64 C8.+ 24,62.74 24,59.56 JP10.1 | 69.22,35.31 69.22,44.45 68.58,45.09
  Bottom 0.254: v106.05,63.5 106.05,62.87 JP3.3 | JP2.7 v123.83,61.59 | 166.93,99.06 B1.+ | 158.12,86.36 158.12,83.82
  Bottom 0.406: v119.06,14.29 129.54,14.29 U13.VCC | v81.6,14.29 92.08,14.29 U12.VCC | v44.13,14.29 54.61,14.29 U11.VCC | U3.RESET 106.17,47.12 106.17,35.81 106.68,35.31 JP11.1 | JP1.1 154.31,59.69 157.48,62.87 157.48,77.47 158.12,78.11 158.12,83.82 | 166.93,99.06 164.47,99.06 158.12,92.71 158.12,86.36
+24V  (via drill 0.6)
  Top 0.254: 57.78,87 55.88,88.9 55.88,95.25 57.66,97.03 57.66,116.97 55.24,119.38 35.56,119.38 33.02,116.84 X5.1 | K2.2 61.49,90.45 D1.C
  Top 0.61: X5.1 33.02,111.12 36.51,107.63 36.51,98.42 34.92,96.52 34.92,90.56 D2.C 37.92,88.02 K1.2 | 57.78,87 D1.C | 3.81,62.87 C6.+ 12.06,65.41 13.34,66.67 17.14,66.67 | 17.14,66.67 20.3,66.67 U7.1 | C7.1 17.52,67.05 17.14,66.67
  Top 1.27: 34.29,22.86 U10.VMOT | U13.VMOT 146.69,22.54 147,22.86 | 109.22,22.86 U12.VMOT | 71.75,22.86 U11.VMOT
  Top 1.676: U2.VMOT3 U2.VMOT2 U2.VMOT1 | U3.VMOT3 U3.VMOT2 U3.VMOT1 | U4.VMOT3 U4.VMOT2 U4.VMOT1 | U1.VMOT1 U1.VMOT2 U1.VMOT3
  Top 2.54: D3.C 5.71,74.93 11.43,74.93 v11.43,84.45
  Top 5.08: 11.43,22.86 3.81,22.86 3.81,62.87 3.81,74.93 5.71,74.93 | 11.43,22.86 34.29,22.86 48.9,22.86 | 48.9,22.86 71.75,22.86 86.36,22.86 | 86.36,22.86 109.22,22.86 123.83,22.86 | 123.83,22.86 147,22.86 | U1.VMOT2 11.43,22.86 | 48.9,22.86 U2.VMOT2 | 86.36,22.86 U3.VMOT2 | 123.83,22.86 U4.VMOT2
  Bottom 1.676: C4.+ 15.24,6.35 11.43,10.16 U1.VMOT2 | U2.VMOT2 48.9,5.21 C3.+ | C2.+ 86.23,11.94 U3.VMOT2 | C1.+ 123.7,11.94 U4.VMOT2
  Bottom 2.54: X5.1 32.7,115.57 31.43,116.84 26.04,116.84 11.43,102.23 v11.43,84.45
AA
  Bottom 1.27: U13.D 141.6,14.92 142.24,14.29 143.51,14.29 144.15,13.65 U4.A2
  Bottom 1.676: A.4 144.15,5.49 U4.A2 U4.A1
AB
  Bottom 1.27: U4.B2 U13.C
  Bottom 1.524: 139.78,11.99 U4.B2
  Bottom 1.676: A.3 139.78,11.99 139.7,12.06 | U4.B2 U4.B1
AC
  Bottom 1.27: U4.C1 U13.B
  Bottom 1.524: 135.81,11.99 U4.C1
  Bottom 1.676: A.2 135.81,11.99 135.89,12.06 | U4.C1 U4.C2
AD
  Bottom 1.27: U13.A 133.99,14.61 133.67,14.29 132.08,14.29 131.44,13.65 U4.D1
  Bottom 1.676: A.1 131.44,5.49 U4.D1 U4.D2
ADC1
  Top 0.406: U4.DCY1 JP2.8
ADC2
  Top 0.406: U4.DCY2 JP2.6
ADIR
  Top 0.254: U9.4 128.91,60.33 133.99,55.88 U4.DIR
  Bottom 0.254: U13.DIR 128.91,41.59 133.99,46.67 U4.DIR
AENABLE
  Top 0.254: U9.5 130.18,62.23 137.16,55.24 145.41,55.24 146.69,53.98 U4.EN
  Bottom 0.254: U13.ENABLE U4.EN
AM1
  Top 0.406: U4.M1 JP2.4
AM2
  Top 0.406: U4.M2 JP2.2
ASTEP  (via drill 0.6)
  Top 0.254: U9.6 131.44,62.23 137.16,56.52 145.41,56.52 149.22,52.7 U4.CLOCK | v143.51,42.86 v149.22,42.86
  Bottom 0.254: v143.51,42.86 133.35,42.86 131.44,40.96 U13.STEP | v149.22,42.86 U4.CLOCK
ATQ1
  Top 0.406: U4.TQ1 JP1.4
ATQ2
  Top 0.406: U4.TQ2 JP1.2
BT_SPI_CLOCK  (via drill 0.6)
  Top 0.254: BT2.P$6 180.97,54.62 180.97,52.7 181.45,52.23 BT1.6 v181.45,48.1
  Bottom 0.254: v181.45,48.1 181.45,47.78 SV2.5
BT_SPI_CSB
  Top 0.254: BT2.P$31 186.06,34.32 186.06,36.83 186.25,37.02 BT1.23 186.25,40.45 SV2.6
BT_SPI_MISO
  Top 0.254: BT2.P$32 187.32,37.59 BT1.24 187.45,42.42 185.42,44.45 182.25,44.45 SV2.4
BT_SPI_MOSI
  Top 0.254: BT2.P$2 186.06,54.62 186.06,52.7 186.25,52.51 BT1.2 186.25,49.73 183.51,46.99 182.25,46.99 SV2.3
BT_UART_RESET
  Top 0.254: BT1.5 182.65,52.3 182.25,52.7 BT2.P$5
D+
  Top 0.254: X2.D+ 179.09,83.19 177.16,83.19 172.72,87.63 149.86,87.63 149.22,87 LPC1.37
D-
  Top 0.254: LPC1.36 151.76,86.36 152.4,87 172.09,87 177.16,81.92 178.34,81.92 X2.D-
ETHRD+
  Top 0.254: U6.7 171.96,70.61 171.45,71.12 171.45,72.39 159.38,84.45 LPC1.33
ETHRD-
  Top 0.254: 172.91,71.88 U6.8 172.93,72.18 161.93,83.19 LPC1.32
ETHTD+
  Top 0.254: U6.1 171.32,62.99 169.54,64.77 169.54,71.75 159.38,81.92 156.21,81.92 154.31,83.82 LPC1.35
ETHTD-
  Top 0.254: LPC1.34 156.84,83.82 157.48,83.19 159.38,83.19 170.18,72.39 170.18,71.12 170.81,70.48 170.81,66.38 U6.2
GND  (via drill 0.6, 0.61)
  Top 0.254: 188.92,93.98 188.92,92.89 U16.GND3 187.92,90.77 186.69,89.53 183.39,89.53 X2.P$1 179.06,89.2 178.73,89.53 | 188.92,93.98 U16.GND1 188.55,105.41 181.61,105.41 175.39,99.19 U16.CD2 | U16.6 188.02,94.88 188.92,93.98 | U9.2 126.36,66.04 125.09,67.31 | 107.95,67.31 109.22,67.31 | 109.22,67.31 119.38,67.31 | 119.38,67.31 120.65,67.31 | 120.65,67.31 125.09,67.31 | U8.12 121.92,66.04 120.65,67.31 | U8.11 120.65,66.04 119.38,67.31 | U8.2 109.22,66.04 107.95,67.31 | 109.22,67.31 110.49,68.58 U8.22 110.49,74.3 106.05,78.74 LPC1.54 | U8.13 121.92,68.58 120.65,67.31 | U9.22 127.64,68.58 126.36,67.31 | 125.09,67.31 126.36,67.31 | 137.79,67.31 139.06,66.04 U9.12 139.22,64.14 141.6,64.14 144.78,60.96 v144.78,57.78 | 126.36,67.31 136.53,67.31 | 136.53,67.31 137.79,67.31 | U9.11 137.79,66.04 136.53,67.31 | U9.13 139.06,68.58 137.79,67.31 | 178.73,89.53 U16.CD1 | R6.1 70.06,53.76 v69.85,53.98 | C5.2 177.63,76.2 U6.GNDR | WIFI2.GND1 188.59,3.81 189.23,4.45 189.23,7.62 | 189.23,8.26 189.23,9.53 | 189.23,10.16 189.23,11.43 | 189.23,13.34 189.23,13.97 | 189.23,13.97 189.23,15.88 | 189.23,15.88 189.23,16.51 | 189.23,16.51 189.23,17.14 | 189.23,17.14 189.23,19.68 | 189.23,19.68 189.23,21.59 | 189.23,21.59 189.23,23.2 WIFI2.GND10 | WIFI2.GND9 190.18,21.9 189.23,21.59 | WIFI2.GND8 190.08,19.9 189.23,19.68 | WIFI2.GND7 190.56,17.84 189.23,17.14 | WIFI2.GND6 189.89,15.9 189.23,15.88 | WIFI2.GND5 189.94,13.9 189.23,13.97 | WIFI2.GND4 190.34,11.9 189.23,11.43 | WIFI2.GND3 190.24,9.9 189.23,9.53 | WIFI2.GND2 190.56,7.68 190.5,7.62 189.23,7.62 | 189.23,8.26 165.1,8.26 164.47,8.89 164.47,13.34 163.9,13.9 WIFI1.19 162.53,13.93 162.53,15.88
  Top 0.254: 189.23,8.26 189.23,7.62 | BT2.P$19 170.81,34.32 170.81,36.2 170.18,36.83 170.18,41.27 170.22,41.32 BT1.28 172.76,41.32 173.35,41.91 173.35,46.99 172.83,47.52 BT1.29 170.67,47.52 170.18,48.01 170.18,52.07 170.81,52.7 170.81,54.62 BT2.P$14 | 173.35,54.62 173.35,52.07 174.25,51.17 BT1.12 174.25,49.91 177.16,46.99 177.16,44.45 SV2.2 | 173.35,54.62 BT2.P$14 | BT2.P$12 173.35,54.62 | BT1.1 187.45,52.58 187.32,52.7 BT2.P$1 | 189.23,16.51 R21.1 | 189.23,13.34 R31.1 | 189.23,11.43 189.23,13.34 | 189.23,10.16 R30.1 | 189.23,9.53 189.23,10.16 | WIFI2.15 162.53,15.88 | 162.53,15.88 WIFI1.18 | R14.1 166.27,51.33 166.37,51.44 166.37,52.7 167.64,53.98 167.64,56.52 168.4,57.28 170.7,57.28 BT2.P$14 | R32.1 28.17,101.6 LED10.C Q4.S | Q3.2 54.29,82.02 R17.1 | R17.1 56.28,81.28 LED4.C | R20.1 155.26,102.77 Q1.2 155.26,100.65 154.31,99.69 154.31,98.42 163.19,89.53 178.73,89.53 | 107.95,67.31 106.05,67.31 102.23,63.5 | v77.47,84.45 LED1.C | R17.1 54.19,82.13 v56.52,83.82 | R2.1 145,53.12 v144.78,53.34 | R4.1 107.53,53.76 v107.31,53.98
  Top 0.406: R8.1 32.6,52.28 v33.02,52.7 | 41.4,70.61 44.7,70.61 44.83,70.48 44.83,69.22 C11.2 | 41.4,70.61 39.37,72.64 U5.3 39.24,72.52 37.59,72.52 35.69,70.61 28.45,70.61 28.32,70.48 | C10.- 36.45,61.21 34.54,61.21 34.54,60.33 LED6.C | 41.66,58.55 47.12,58.55 47.24,58.67 47.24,60.33 LED5.C | 41.66,58.55 37.85,62.36 C10.- | 41.4,70.61 41.27,70.48 41.27,69.6 38.48,66.8 38.48,63.25 C10.- | v17.14,73.03 v17.14,74.3 | v18.41,73.03 v17.14,73.03 | v17.14,74.3 v18.41,74.3 | v17.14,74.3 v17.14,75.56 | v17.14,75.56 v18.41,75.56 | v17.14,75.56 v17.14,76.83 | v17.14,76.83 v18.41,76.83 | v17.14,76.83 v17.14,78.11 | v17.14,78.11 v18.41,78.11 v19.68,78.11 v20.95,78.11 21.59,78.11 v22.23,78.11 v23.5,78.11 v24.77,78.11 v26.04,78.11 v27.3,78.11 | v17.14,78.11 v17.14,79.38 | v17.14,79.38 v18.41,79.38 | v17.14,79.38 17.14,81.92 | v17.14,73.03 17.02,72.9 | v27.3,74.3 v27.3,73.03 | v27.3,75.56 v27.3,74.3 | v27.3,76.83 v27.3,75.56 | v27.3,73.03 v28.57,73.03 | v27.3,74.3 v28.57,74.3 | v27.3,75.56 v28.57,75.56 | v27.3,76.83 v28.57,76.83 | 28.32,70.48 28.32,69.22 C9.2 | 28.32,70.48 28.19,70.61 26.54,70.61 26.16,70.99 26.16,72.52 26.54,72.9 27.18,72.9 v27.3,73.03 | v27.3,78.11 v28.57,78.11 | v19.68,79.38 v20.95,79.38 21.59,79.38 v22.23,79.38 v23.5,79.38 v24.77,79.38 v26.04,79.38 v27.3,79.38 v28.57,79.38 | v27.3,78.11 v27.3,76.83 | Q2.2 74.93,82.13 R9.1 76.64,81.51 LED1.C | 41.66,58.55 36.07,58.55 v33.15,55.63
  Top 0.61: v81.92,104.78 ZSTOP.2 | v81.92,93.34 DOOR.2 | v81.92,81.92 PAUSE.2 | C7.2 17.78,72.39 v17.14,73.03
  Top 0.813: 22.86,74.3 U7.3 22.86,73.66
  Top 2.54: U7.3 21.59,75.53 21.59,78.11 21.59,79.38 17.78,80.64 17.78,89.53 12.7,89.53 R28.4
  Bottom 0.254: 151.76,15.88 WIFI2.15 | BT2.P$12 174.62,56.52 178.44,60.33 | BT2.P$1 186.06,54.61 186.06,57.15 184.78,58.42 180.21,58.42 U6.GNDL | v77.47,84.45 79.38,84.45 v81.92,81.92 | v144.78,57.78 v144.78,53.34 | v107.31,53.98 107.31,53.34 104.14,50.16 100.97,50.16 98.42,52.7 98.42,63.5
  Bottom 0.406: U6.GNDL 179.2,59.69 | v33.15,55.63 33.15,52.83 v33.02,52.7 | U4.PGND1 155.07,12.32
  Bottom 0.61: ISPBOOT.3 ISPBOOT.4 | ISPBOOT.3 159.74,58.14 159.7,58.1 | CAN2.2 159.82,67.31 ISPBOOT.3 | I2C0.2 112.39,119.38 113.03,120.02 124.46,120.02 | 154.94,120.02 165.3,120.02 RESET.4 RESET.3 179.35,120.24 180.97,118.62 180.97,102.23 | 154.94,120.02 132.08,120.02 | 132.08,120.02 124.46,120.02 | UART3.2 154.31,119.38 154.94,120.02 | ADC.2 123.83,119.38 124.46,120.02 | JP7.1 131.44,119.38 132.08,120.02 | PAUSE.2 TOOLZERO.2 | DOOR.2 SPINSPD.2 | ZSTOP.2 ASTOP.2 | 54.61,63.5 80.64,63.5 81.92,64.77 v81.92,81.92 v81.92,93.34 v81.92,104.78 81.92,113.98 84.14,116.2 XSTOP.2 YSTOP.2 | 14.61,69.85 C6.- | C8.- 21.59,69.22 22.86,70.48
  Bottom 0.813: U6.GNDL U6.GNDR 178.81,75.94 180.34,77.47 182.75,77.47 X2.P$2 182.88,77.34 182.88,83.19 | X2.GND 181.63,84.44 182.88,83.19 | 182.88,83.19 183.06,83.36 X2.P$1 182.88,89.38 182.88,100.33 180.97,102.23 175.26,107.95 LPC1.1 | 179.2,59.69 178.44,60.33 161.93,60.33 159.7,58.1 158.12,56.52 158.12,25.4 155.57,22.86 151.76,22.86
  Bottom 1.27: 53.98,22.86 U11.GND1 | 69.22,22.86 U11.GND2 | 91.44,22.86 U12.GND1 | 106.68,22.86 U12.GND2 | 16.51,22.86 U10.GND1 | 31.75,22.86 U10.GND2 | U13.GND2 144.15,22.54 143.83,22.86 | U13.GND1 128.91,22.54 129.22,22.86
  Bottom 1.676: C4.- 11.18,5.33 5.08,11.43 3.81,22.86 | C3.- 44.45,5.08 39.37,10.16 U1.PGND2 | U4.PGND3 U4.PGND2 U4.PGND1 | C1.- 118.75,5.08 114.3,9.53 U3.PGND2 | U3.PGND2 U3.PGND1 | U3.PGND2 U3.PGND3 | C2.- 80.64,5.08 76.83,8.89 U2.PGND2 | U2.PGND2 U2.PGND1 | U2.PGND2 U2.PGND3 | U1.PGND2 U1.PGND3 | U1.PGND2 U1.PGND1 | U1.DGND 5.08,47.62 3.81,69.85 | 46.35,22.86 U2.DGND | 83.82,22.86 U3.DGND | 121.28,22.86 U4.DGND
  Bottom 1.778: Q4.S 23.5,106.05 22.23,104.78 22.23,78.74 24.13,75.56 v19.68,71.75 v18.41,73.03
  Bottom 3.81: 39.37,22.86 31.75,22.86 16.51,22.86 3.81,22.86 | 39.37,22.86 46.35,22.86 53.98,22.86 69.22,22.86 76.83,22.86 | 76.83,22.86 83.82,22.86 91.44,22.86 106.68,22.86 114.3,22.86 | 114.3,22.86 121.28,22.86 129.22,22.86 143.83,22.86 151.76,22.86 151.76,15.88 U4.PGND2 | 114.3,22.86 U3.PGND2 | 76.83,22.86 U2.PGND2 | 39.37,22.86 U1.PGND2
  Bottom 5.08: 3.81,22.86 3.81,69.85 14.61,69.85 18.41,69.85 v18.41,73.03 | 22.86,69.85 22.86,70.48 22.86,73.66 24.13,73.66 22.23,78.74
  other vias: 27.3,71.75 28.57,71.75 33.66,71.75 34.92,71.75 34.92,73.03 33.66,73.03 33.66,74.3 33.66,75.56 33.66,76.83 33.66,78.11 33.66,79.38 34.92,79.38 34.92,78.11 34.92,76.83 34.92,75.56 34.92,74.3 36.2,79.38 36.2,78.11 37.47,78.11 37.47,79.38 38.73,79.38 38.73,78.11 40.01,79.38 40.01,78.11 41.27,79.38 41.27,78.11 45.09,79.38 43.81,79.38 42.55,79.38 42.55,78.11 43.81,78.11 45.09,78.11 45.09,76.83 43.81,76.83 43.81,75.56 45.09,75.56 45.09,74.3 43.81,74.3 43.81,73.03 45.09,73.03 45.09,71.75 43.81,71.75 18.41,71.75 17.14,71.75 24.77,71.75 24.77,73.03 24.77,74.3 24.77,75.56 24.77,76.83 23.5,76.83 22.23,76.83 20.95,76.83 20.95,75.56 22.23,75.56 23.5,75.56 23.5,74.3 22.23,74.3 20.95,74.3 23.5,73.03 22.23,73.03 20.95,73.03 23.5,71.75 22.23,71.75 20.95,71.75 37.47,76.83 38.73,76.83 40.01,76.83 41.27,76.83 41.27,75.56 40.01,75.56 38.73,75.56 37.47,75.56 37.47,74.3 38.73,74.3 40.01,74.3 41.27,74.3 41.27,73.03 40.01,73.03 38.73,73.03 37.47,73.03 37.47,71.75 38.73,71.75 40.01,71.75 41.27,71.75 42.55,71.75 42.55,73.03 42.55,74.3 42.55,75.56 42.55,76.83 36.2,76.83 36.2,75.56 36.2,74.3 36.2,73.03 36.2,71.75 26.04,71.75 26.04,73.03 26.04,74.3 26.04,75.56 26.04,76.83 19.68,76.83 19.68,75.56 19.68,74.3 19.68,73.03
  pour Bottom: -2.54,124.46 193.04,124.46 193.04,-2.54 -2.54,-2.54
  pour Top: -2.54,96.52 20.32,96.52 20.32,124.46 193.04,124.46 193.04,-2.54 -2.54,-2.54
N$1
  Bottom 0.254: U10.SLEEP U10.RESET
N$2
  Bottom 0.254: U11.SLEEP U11.RESET
N$3
  Bottom 0.254: U12.SLEEP U12.RESET
N$4
  Top 0.406: U13.SLEEP 133.99,28.96 136.53,28.96 U13.RESET
N$5
  Top 0.406: Q2.3 73.98,90.42 K2.1
  Top 0.61: D1.A 57.78,94.61 60.33,97.16 71.12,97.16 73.66,94.61 73.66,90.74 K2.1
N$6
  Top 0.406: R12.2 25.14,66.99 U7.2
N$7
  Bottom 0.254: U10.MS1 JP13.2
N$8
  Top 0.406: R3.2 101.39,47.84 U3.PROTECT
N$9
  Bottom 0.254: U10.MS2 JP13.4
N$10
  Top 0.254: JP13.6 23.91,32.7 R22.2
  Bottom 0.254: U10.ROSC JP13.6
N$11
  Bottom 0.254: U11.MS1 JP12.2
N$12
  Bottom 0.254: U11.MS2 JP12.4
N$13
  Top 0.254: JP12.6 61.38,32.7 R24.2
  Bottom 0.254: U11.ROSC JP12.6
N$14
  Bottom 0.254: U12.MS1 JP11.2
N$15
  Bottom 1.778: K1.NO 53.31,110.84 X1.1
N$16
  Top 0.406: R1.2 138.85,47.84 U4.PROTECT
N$17
  Top 0.254: R10.1 77.38,78.74 LED1.A
N$18
  Bottom 1.778: K2.NO 73.94,110.84 X3.1
N$19
  Bottom 1.778: K2.C X3.2
N$20
  Bottom 1.778: K2.NC 61.95,110.84 X3.3
N$21
  Bottom 0.254: U12.MS2 JP11.4
N$22
  Top 0.254: JP11.6 98.84,32.7 R25.2
  Bottom 0.254: JP11.6 U12.ROSC
N$23
  Bottom 0.254: U13.MS1 JP8.2
N$24
  Bottom 0.254: U13.MS2 JP8.4
N$25
  Top 0.254: BT1.16 177.6,36.66 BT2.P$24
N$26
  Top 0.254: BT1.15 176.65,36.95 175.9,36.2 175.9,34.32 BT2.P$23
N$27
  Top 0.813: U5.2 44.87,66.95 R15.2
N$28
  Top 2.54: D3.A 5.08,82.55
  Top 5.08: F1.3 F1.4 5.08,82.55
N$29
  Bottom 1.778: K1.C X1.2
N$30
  Top 0.406: Q3.3 53.34,90.17 K1.1
  Top 0.61: D2.A 37.47,95.89 40.01,97.16 50.8,97.16 53.34,94.61 53.34,90.74 K1.1
N$31
  Top 0.254: JP8.6 136.31,32.7 R26.2
  Bottom 0.254: U13.ROSC JP8.6
N$32
  Top 0.254: BT1.21 183.85,36.53 183.51,36.2 183.51,34.32 BT2.P$29 182.85,31.11 159.38,31.11 159.38,49.53 161.19,51.33 R13.1
N$33
  Top 0.254: LED2.C R13.2
N$34
  Top 0.254: BT1.19 181.45,36.67 180.97,36.2 180.97,34.32 BT2.P$27 180.94,31.75 168.28,31.75 167.64,32.38 167.64,40.64 165.42,42.86 LED3.A
N$35
  Top 0.254: LED4.A 54.42,78.51 R18.1
N$36
  Top 0.254: LED3.C R14.2
N$37
  Bottom 1.778: K1.NC 41.31,110.52 X1.3
N$38
  Top 0.254: B1.- 162.17,92.64 Q1.3
N$39
  Top 0.254: R23.1 32.17,60.98 LED6.A
N$40
  Top 0.406: LED5.A 44.2,60.33 44.2,61.72 44.32,61.85 44.7,61.85 44.83,61.98 44.83,62.87 R11.1
N$41
  Top 0.254: BT1.22 185.05,35.85 BT2.P$30 | S1.2 S1.1
  Bottom 0.254: BT2.P$30 184.78,35.56 183.51,34.29 183.51,32.38 182.88,31.75 166.97,31.75 S1.2
N$42
  Top 0.254: S1.4 S1.3 163.59,39.13 164.47,40.01 164.47,41.49 R34.2
N$43
  Top 0.406: R7.2 26.45,47.84 26.67,47.84 U1.PROTECT
N$44
  Top 0.406: R5.2 63.92,47.84 U2.PROTECT
N$45
  Top 0.254: BT1.17 179.05,36.81 178.44,36.2 178.44,34.32 BT2.P$25
N$46
  Top 0.254: BT1.18 180.25,36.13 BT2.P$26
N$47
  Top 0.254: BT2.P$20 172.06,35.59 172.06,36.23 170.81,37.47 170.81,39.68 BT1.30
N$48
  Top 0.254: BT1.35 171.45,48.9 170.81,49.53 170.81,51.44 172.09,52.7 BT2.P$13
N$49
  Top 0.254: BT1.7 180.25,52.16 179.71,52.7 BT2.P$7
N$50
  Top 0.254: BT1.8 179.05,52.09 178.44,52.7 178.44,54.62 BT2.P$8
N$51
  Top 0.254: BT1.9 177.85,52.02 177.16,52.7 BT2.P$9
N$52
  Top 0.254: BT1.10 176.65,51.95 175.9,52.7 175.9,54.62 BT2.P$10
N$53
  Top 0.254: BT1.20 182.65,35.99 BT2.P$28
N$54
  Top 0.254: BT1.3 185.05,52.44 184.78,52.7 BT2.P$3
N$55
  Top 0.254: BT1.4 183.85,52.37 183.51,52.7 183.51,54.62 BT2.P$4
N$56
  Top 0.254: BT2.P$18 169.54,41.91 170.18,42.55 171.38,42.55 BT1.31
N$57
  Top 0.254: BT2.P$17 169.51,33.05 168.28,34.29 168.28,42.55 169.54,43.81 BT1.32
N$58
  Top 0.254: BT1.33 169.61,45.02 168.28,46.35 168.28,54.62 BT2.P$16
N$59
  Top 0.254: BT1.34 170.32,46.22 169.54,46.99 BT2.P$15
N$60
  Top 0.254: WIFI1.34 WIFI2.31
N$61
  Top 0.254: WIFI1.30 178.06,5.34 WIFI2.27
N$62
  Top 0.254: WIFI1.31 180.06,4.8 WIFI2.28
N$63
  Top 0.254: WIFI1.32 182.06,4.26 WIFI2.29
N$64
  Top 0.254: WIFI2.2 WIFI1.2 186.06,20.32 185.42,19.68 180.34,19.68 179.07,18.41 179.07,15.01 LED9.A
N$65
  Top 0.254: WIFI2.3 184.06,28.03 WIFI1.3 184.06,21.5 183.51,20.95 180.34,20.95 177.8,18.41 177.8,13.11 LED8.A
N$66
  Top 0.254: WIFI2.1 188.06,28.04 WIFI1.1 187.96,25.3 187.96,20.32 186.06,18.41 180.97,18.41 180.75,18.18 LED7.A
N$67
  Top 0.254: WIFI1.4 182.06,27.49 WIFI2.4
N$68
  Top 0.254: WIFI1.5 180.06,26.95 WIFI2.5
N$69
  Top 0.254: WIFI1.6 178.06,26.41 WIFI2.6
N$70
  Top 0.254: WIFI1.7 176.06,25.87 WIFI2.7
N$71
  Top 0.254: WIFI1.8 174.06,25.96 173.35,26.67 172.72,26.67 WIFI2.8
N$72
  Top 0.254: WIFI1.9 172.06,25.43 170.81,26.67 170.18,26.67 WIFI2.9
N$73
  Top 0.254: WIFI1.10 170.06,25.52 168.91,26.67 168.28,26.67 166.37,28.57 WIFI2.10
N$74
  Top 0.254: WIFI1.11 168.06,25.61 166.37,27.3 164.47,27.3 WIFI2.11
N$75
  Top 0.254: LED7.C R21.2
N$76
  Top 0.254: LED8.C R30.2
N$80
  Top 0.254: WIFI1.17 161.17,17.9 WIFI2.14
N$81
  Top 1.778: Q4.D 30.48,107.95 27.94,110.49 X5.2
N$82
  Top 0.254: LED9.C R31.2
N$83
  Top 0.254: R33.1 28.17,99.06 LED10.A
N$85
  Top 0.254: WIFI1.22 161.01,7.9 WIFI2.19
N$86
  Top 0.254: WIFI1.23 163.25,6.4 162.56,5.71 WIFI2.20
N$87
  Top 0.254: WIFI2.21 161.29,3.17 162.56,4.45 164.1,4.45 WIFI1.24
N$88
  Top 0.254: WIFI2.22 163.83,3.17 165.74,5.08 166.74,5.08 WIFI1.25
N$89
  Top 0.254: WIFI2.23 167,4.45 168.1,4.45 WIFI1.26
N$90
  Top 0.254: WIFI2.24 168.84,3.17 WIFI1.27
N$91
  Top 0.254: WIFI1.28 174.06,5.79 172.72,4.45 171.45,4.45 170.81,3.81 WIFI2.25
N$92
  Top 0.254: WIFI1.29 176.06,5.88 WIFI2.26
N$103
  Top 0.254: WIFI1.33 184.06,3.72 WIFI2.30
P0.0
  Top 0.254: LPC1.9 UART3.3
P0.1
  Top 0.254: LPC1.10 UART3.4
P0.2  (via drill 0.6)
  Top 0.254: WIFI1.12 166.06,25.71 165.1,26.67 162.56,26.67 WIFI2.12 158.75,30.48 158.75,56.52 147.96,67.31 v147.96,73.66 | LPC1.21 121.28,104.78 123.19,102.87 141.6,102.87 147.96,96.52 v147.96,87.63
  Bottom 0.254: v147.96,73.66 v147.96,87.63
P0.3  (via drill 0.6)
  Top 0.254: WIFI1.13 161.29,25.4 WIFI2.13 158.12,28.57 158.12,55.88 v145.41,68.58 | v145.41,87.63 145.41,96.52 140.34,101.6 121.92,101.6 118.75,104.78 LPC1.22
  Bottom 0.254: v145.41,68.58 v145.41,87.63
P0.4
  Top 0.254: CAN2.4 165.74,74.3 159.38,80.64 149.22,80.64 146.69,83.19 LPC1.38
P0.5
  Top 0.254: CAN2.3 164.47,69.85 163.19,71.12 163.19,75.56 159.38,79.38 147.96,79.38 144.15,83.19 LPC1.39
P0.6
  Top 0.254: U16.2 178.02,99.28 175.9,97.16 163.83,97.16 163.19,97.79 163.19,109.22 162.56,109.86 156.21,109.86 LPC1.8
P0.7
  Top 0.254: LPC1.7 158.12,109.22 160.02,109.22 160.66,108.58 160.66,97.16 162.08,95.85 184.94,95.85 U16.5
P0.8
  Top 0.254: U16.7 178,93.78 176.78,95.12 161.42,95.12 159.38,97.16 LPC1.6
P0.9
  Top 0.254: U16.3 178.19,98.18 176.53,96.52 162.56,96.52 161.93,97.16 LPC1.5
P0.10  (via drill 0.6)
  Top 0.254: BT2.P$21 173.35,34.32 173.35,36.83 BT1.13 174.25,47.25 v174.62,47.62 | LPC1.40 141.6,80.64 145.41,76.83 151.76,76.83 153.03,75.56 153.03,67.31 154.94,65.41 154.94,62.87 155.57,62.23 168.91,62.23 v173.35,58.42
  Bottom 0.254: v173.35,58.42 173.35,48.9 v174.62,47.62
P0.11  (via drill 0.6)
  Top 0.254: BT2.P$22 174.62,36.2 175.45,37.02 BT1.14 175.45,45.27 v175.9,45.72 | v170.81,58.42 168.28,60.96 155.57,60.96 153.67,62.87 153.67,65.41 151.76,67.31 151.76,74.93 151.13,75.56 144.15,75.56 139.06,80.64 LPC1.41
  Bottom 0.254: v175.9,45.72 173.99,45.72 170.81,48.9 v170.81,58.42
P0.15
  Top 0.254: JP7.5 LPC1.13
P0.16
  Top 0.254: JP7.4 LPC1.14
P0.17  (via drill 0.6)
  Top 0.254: v102.87,53.98 102.87,51.65 R3.1
  Top 0.406: R3.1 R4.2
  Bottom 0.254: LPC1.12 144.15,104.14 137.79,97.79 137.79,71.12 134.62,67.94 106.68,67.94 102.87,64.14 v102.87,53.98
P0.18  (via drill 0.6)
  Top 0.254: v140.34,53.34 140.34,51.65 R1.1
  Top 0.406: R1.1 R2.2
  Bottom 0.254: LPC1.11 146.69,104.78 140.34,98.42 v140.34,53.34
P0.21  (via drill 0.6)
  Top 0.254: v116.2,91.44 LPC1.23 | v28.57,52.07 28.57,50.59 R7.1
  Top 0.406: R7.1 R8.2
  Bottom 0.254: v116.2,91.44 116.2,87.63 114.94,86.36 114.94,83.19 101.6,69.85 101.6,63.5 100.33,62.23 100.33,53.98 101.6,52.7 104.14,52.7 104.78,53.34 104.78,55.24 105.41,55.88 108.58,55.88 109.22,55.24 109.22,49.53 108.58,48.9 99.06,48.9 98.42,49.53 68.58,49.53 67.94,50.16 30.48,50.16 v28.57,52.07
P0.23  (via drill 0.6)
  Top 0.254: R28.2 24.28,103.35 26.04,101.6 26.04,97.16 26.67,96.52 31.11,96.52 32.38,95.25 32.38,87.63 37.15,82.87 48.26,82.87 50.16,80.96 50.16,76.83 52.07,74.93 97.79,74.93 100.33,77.47 100.33,83.19 104.14,87 v107.31,87
  Bottom 0.254: LPC1.15 136.53,106.05 126.36,95.89 114.3,95.89 113.67,95.25 113.67,88.9 111.76,87 v107.31,87
P0.24  (via drill 0.6)
  Top 0.254: R28.3 30.48,95.89 31.75,94.61 31.75,87 36.51,82.23 47.94,82.23 49.53,80.64 49.53,76.2 51.44,74.3 98.42,74.3 100.97,76.83 100.97,81.92 v103.5,84.45
  Bottom 0.254: v103.5,84.45 103.5,86.36 105.41,88.27 111.76,88.27 113.03,89.53 113.03,95.89 114.3,97.16 125.09,97.16 133.99,106.05 LPC1.16
P0.25
  Top 0.254: ADC.3 121.28,113.67 122.56,112.39 129.54,112.39 131.44,110.49 LPC1.17
P0.26  (via drill 0.6)
  Top 0.254: R22.1 23.6,34.92 24.77,34.92 25.72,33.97 33.02,33.97 33.87,34.82 R24.1 61.17,34.61 62.23,34.61 62.87,33.97 77.15,33.97 83.5,27.62 94.61,27.62 95.25,28.26 95.25,33.97 96.1,34.82 R25.1 98.53,34.92 99.69,34.92 100.65,33.97 133.03,33.97 133.88,34.82 R26.1 v135.89,36.58
  Bottom 0.254: LPC1.18 128.91,108.58 130.18,109.86 147.32,109.86 147.96,109.22 147.96,102.23 142.88,97.16 142.88,45.72 143.51,45.09 144.78,45.09 145.41,44.45 145.41,41.91 144.15,40.64 136.53,40.64 135.89,40.01 v135.89,36.58
P0.27
  Top 0.254: LPC1.25 111.12,111.97 R16.1 111.12,112.81 111.12,113.67 109.86,114.94 I2C0.3
P0.28
  Top 0.254: LPC1.26 108.58,111.97 R19.1 107.95,112.61 107.95,114.3 107.31,114.94 I2C0.4
P1.18
  Top 0.254: LPC1.73 105.11,90.5 99.38,84.77 99.38,77.79 97.47,75.88 52.39,75.88 50.8,77.47 50.8,81.28 48.58,83.5 37.78,83.5 33.02,88.27 33.02,98.64 R33.2 R32.2 33.02,102.02 Q4.G
P1.19
  Top 0.254: U8.20 113.03,74.93 109.86,78.11 109.86,87 108.58,88.27 LPC1.72
P1.20
  Bottom 0.254: LPC1.71 109.53,88.9 104.46,88.9 101.92,86.36 101.92,74.93 99.06,72.07 99.06,67.94 97.16,66.04 SPI0.5
P1.21
  Bottom 0.254: LPC1.70 101.93,93.04 100.01,91.12 100.01,75.56 96.52,72.07 96.52,70.48 SPI0.6
P1.22
  Top 0.254: LPC1.69 108.58,93.03 107.31,91.76 103.82,91.76 TOOLZERO.3
P1.23
  Bottom 0.254: LPC1.68 109.84,91.76 103.82,91.76 100.97,88.9 100.97,75.25 97.79,72.07 97.79,68.58 96.52,67.31 93.34,67.31 SPI0.4
P1.24
  Bottom 0.254: SPI0.3 90.81,67.31 90.81,69.22 92.08,70.48 93.34,70.48 99.06,76.2 99.06,92.71 101.6,95.25 105.72,95.25 LPC1.67
P1.25
  Bottom 0.254: LPC1.66 108.57,95.58 107.31,96.84 97.47,96.84 SPINSPD.3
P1.26
  Top 0.254: LPC1.65 111.12,95.57 109.86,94.3 105.41,94.3 101.92,97.79 93.34,97.79 92.08,96.52 92.08,89.53 PAUSE.3
P1.27
  Top 0.254: LPC1.64 104.76,98.12 103.82,99.06 81.28,99.06 80.64,98.42 80.64,77.79 79.38,76.52 53.66,76.52 52.7,77.47 52.7,79.16 R18.2 R17.2 52.39,82.02 Q3.1
P1.28
  Top 0.254: LPC1.63 108.58,98.11 107.31,96.84 104.78,96.84 103.19,98.42 89.53,98.42 DOOR.3
P1.29  (via drill 0.6)
  Top 0.254: v131.44,105.41 155.57,105.41 157.06,103.92 R20.2 157.16,102.77 Q1.1
  Bottom 0.254: LPC1.62 124.16,98.12 v131.44,105.41
P1.30
  Top 0.254: X2.VBUS 177.19,84.44 173.35,88.27 160.02,88.27 144.15,104.14 127.64,104.14 126.36,105.41 LPC1.19
P1.31  (via drill 0.6, 0.61)
  Top 0.254: v65.66,53.09 65.66,51.56 R5.1 | LPC1.20 121.92,109.86 118.11,109.86 117.47,109.22 v117.47,93.98
  Top 0.406: R5.1 R6.2
  Bottom 0.254: v117.47,93.98 115.57,93.98 114.94,93.34 114.94,88.9 112.39,86.36 112.39,83.19 100.97,71.75 100.97,64.14 99.69,62.87 99.69,53.34 101.6,51.44 104.14,51.44 106.05,53.34 106.05,54.61 106.68,55.24 107.95,55.24 108.58,54.61 108.58,50.16 107.95,49.53 99.69,49.53 99.06,50.16 69.85,50.16 66.67,53.34 65.91,53.34 v65.66,53.09
P2.0
  Top 0.254: U9.18 132.72,74.93 133.99,76.2 135.89,76.2 136.53,76.83 LPC1.42
P2.1
  Top 0.254: U9.19 131.44,74.93 133.99,77.47 LPC1.43
P2.2
  Top 0.254: U9.20 130.18,75.56 131.44,76.83 LPC1.44
P2.3
  Top 0.254: U9.21 LPC1.45
P2.4
  Top 0.254: U8.14 120.65,74.93 121.92,76.2 125.73,76.2 126.36,76.83 LPC1.46
P2.5
  Top 0.254: U8.15 119.38,74.93 121.92,77.47 123.19,77.47 123.83,78.11 LPC1.47
P2.6
  Top 0.254: U8.16 118.11,75.56 121.28,78.74 LPC1.48
P2.7
  Top 0.254: U8.17 116.84,76.2 118.75,78.11 LPC1.49
P2.8
  Top 0.254: U8.18 115.57,77.47 116.2,78.11 LPC1.50
P2.10
  Top 0.254: LPC1.51 113.67,85.72 114.94,87 141.6,87 142.88,85.72 142.88,81.92 146.69,78.11 152.4,78.11 154.94,75.56 154.94,74.02 ISPBOOT.2 ISPBOOT.1 156.63,65.82 R29.1
P2.11
  Top 0.254: U8.19 114.3,75.56 111.12,78.74 LPC1.52
P2.12
  Top 0.254: U8.21 111.76,74.93 108.58,78.11 LPC1.53
P2.13
  Top 0.254: LPC1.27 102.87,111.12 102.87,116.84 100.97,118.75 YSTOP.3
P3.25
  Top 0.254: LPC1.61 99.39,100.66 99.06,100.33 93.98,100.33 92.08,102.23 92.08,106.05 90.81,107.31 ZSTOP.3
P3.26
  Top 0.254: LPC1.60 108.57,100.66 107.31,101.92 104.46,101.92 99.06,107.31 ASTOP.3
P4.28
  Top 0.254: LPC1.59 111.12,100.65 109.86,99.38 104.78,99.38 104.46,99.69 80.64,99.69 79.38,98.42 79.38,77.79 78.74,77.15 73.98,77.15 73.66,77.47 73.66,79.16 R10.2 R9.2 73.03,82.33 Q2.1
P4.29
  Top 0.254: LPC1.58 106.05,104.14 99.69,110.49 93.34,110.49 90.81,113.03 90.81,116.84 88.9,118.75 XSTOP.3
PRE24
  Top 5.08: X4.2 F1.1 F1.2
PREGND
  Top 2.54: R28.1 X4.1
  pour Top (no thermals): 9.53,115.57 15.88,115.57 15.88,102.87 9.53,102.87
RESET
  Top 0.254: LPC1.4 164.47,114.66 RESET.2 RESET.1 172.3,115.99 R27.1
XA
  Bottom 1.27: U10.D 29.21,14.29 31.11,14.29 31.75,13.65 U1.A2
  Bottom 1.676: X.4 31.75,5.49 U1.A2 U1.A1
XB
  Bottom 1.27: U1.B2 U10.C
  Bottom 1.676: X.3 27.38,11.36 28.09,12.06 U1.B1 U1.B2
XC
  Bottom 1.27: U1.C1 U10.B
  Bottom 1.676: X.2 23.42,11.36 U1.C1 U1.C2
XD
  Bottom 1.27: U10.A 21.59,14.29 19.68,14.29 19.05,13.65 U1.D1
  Bottom 1.676: X.1 19.05,5.49 U1.D1 U1.D2
XDC1
  Top 0.406: U1.DCY1 JP10.8
XDC2
  Top 0.406: U1.DCY2 JP10.6
XDIR
  Top 0.254: U8.3 110.49,62.23 109.86,61.59 61.59,61.59 57.78,57.78 36.83,57.78 33.66,54.61 26.04,54.61 21.59,50.16 U1.DIR
  Bottom 0.254: U1.DIR 21.59,46.67 16.51,41.59 U10.DIR
XENABLE
  Top 0.254: U8.4 111.76,62.23 110.49,60.96 62.23,60.96 58.42,57.15 37.47,57.15 34.29,53.98 U1.EN
  Bottom 0.254: U10.ENABLE U1.EN
XM1
  Top 0.406: U1.M1 JP10.4
XM2
  Top 0.406: U1.M2 JP10.2
XSTEP
  Top 0.254: U8.5 113.03,62.23 111.12,60.33 62.87,60.33 59.05,56.52 38.1,56.52 36.83,55.24 U1.CLOCK
  Bottom 0.254: U10.STEP 19.05,27.3 19.68,26.67 35.56,26.67 36.83,27.94 U1.CLOCK
XTQ1
  Top 0.406: U1.TQ1 JP9.4
XTQ2
  Top 0.406: U1.TQ2 JP9.2
YA
  Bottom 1.27: U11.D 66.67,14.61 66.74,14.29 68.52,14.16 69.22,13.84 U2.A2
  Bottom 1.676: Y.4 69.22,5.49 U2.A2 U2.A1
YB
  Bottom 1.27: U2.B2 U11.C
  Bottom 1.676: Y.3 64.84,11.36 U2.B2 U2.B1
YC
  Bottom 1.27: U2.C1 U11.B
  Bottom 1.676: Y.2 60.88,11.36 U2.C1 U2.C2
YD
  Bottom 1.27: U11.A 59.05,14.61 58.74,14.29 57.15,14.29 56.52,13.65 U2.D1
  Bottom 1.676: Y.1 56.52,5.49 U2.D1 U2.D2
YDC1
  Top 0.406: U2.DCY1 JP6.8
YDC2
  Top 0.406: U2.DCY2 JP6.6
YDIR
  Top 0.254: U8.6 114.3,62.23 111.76,59.69 63.5,59.69 59.05,55.24 U2.DIR
  Bottom 0.254: U11.DIR 53.98,41.59 59.05,46.67 U2.DIR
YENABLE
  Top 0.254: U8.7 115.57,62.23 112.39,59.05 73.66,59.05 71.75,57.15 U2.EN
  Bottom 0.254: U11.ENABLE U2.EN
YM1
  Top 0.406: U2.M1 JP6.4
YM2
  Top 0.406: U2.M2 JP6.2
YSTEP  (via drill 0.6)
  Top 0.254: U8.8 116.84,62.23 113.03,58.42 75.56,58.42 74.3,57.15 U2.CLOCK | U11.STEP 56.52,29.77 57.23,30.48 v74.3,30.48
  Bottom 0.254: v74.3,30.48 U2.CLOCK
YTQ1
  Top 0.406: U2.TQ1 JP5.4
YTQ2
  Top 0.406: U2.TQ2 JP5.2
ZA
  Bottom 1.27: U12.D 104.14,14.92 104.78,14.29 106.05,14.29 106.68,13.65 U3.A2
  Bottom 1.676: Z.4 106.68,5.49 U3.A2 U3.A1
ZB
  Bottom 1.27: U3.B2 U12.C
  Bottom 1.676: Z.3 102.31,11.36 U3.B2 U3.B1
ZC
  Bottom 1.27: U3.C1 U12.B
  Bottom 1.676: Z.2 98.35,11.36 97.64,12.06 U3.C2 U3.C1
ZD
  Bottom 1.27: U12.A 96.52,14.61 96.2,14.29 94.61,14.29 93.98,13.65 U3.D1
  Bottom 1.676: Z.1 93.98,5.49 U3.D1 U3.D2
ZDC1
  Top 0.406: U3.DCY1 JP4.8
ZDC2
  Top 0.406: U3.DCY2 JP4.6
ZDIR
  Top 0.254: 118.11,63.5 U8.9 118.11,62.23 113.67,57.78 98.42,57.78 96.52,55.88 U3.DIR
  Bottom 0.254: U12.DIR 91.44,41.59 96.52,46.67 U3.DIR
ZENABLE
  Top 0.254: 119.38,63.5 U8.10 119.38,62.23 114.3,57.15 111.76,57.15 109.22,54.61 U3.EN
  Bottom 0.254: U12.ENABLE U3.EN
ZM1
  Top 0.406: U3.M1 JP4.4
ZM2
  Top 0.406: U3.M2 JP4.2
ZSTEP  (via drill 0.6)
  Top 0.254: U9.3 127.64,62.23 121.92,56.52 113.67,56.52 111.76,54.61 U3.CLOCK | U12.STEP 93.98,40.96 94.61,41.59 v111.76,41.59
  Bottom 0.254: v111.76,41.59 U3.CLOCK
ZTQ1
  Top 0.406: U3.TQ1 JP3.4
ZTQ2
  Top 0.406: U3.TQ2 JP3.2

## Text on the board
tPlace: NO | NO | GND | +24V | NC | COM | NC | COM | GND | 3v3 | RX | TX | +24V | GND | F1 | Hoektronics CNC Controller | Copyright 2012 | License: GPLv3 | D1 | D2 | M1 | M2 | T1 | T2 | D1 | D2 | M1 | M2 | T1 | T2 | D1 | D2 | M1 | M2 | T1 | T2 | D1 | D2 | M1 | M2 | T1 | T2 | X AXIS | Y AXIS | Z AXIS | A AXIS | Docs: http://bit.ly/SAB9fL | Design by: Hoektronics.com